# EAGLE schematic LPC1768 (EAGLE 5.10)
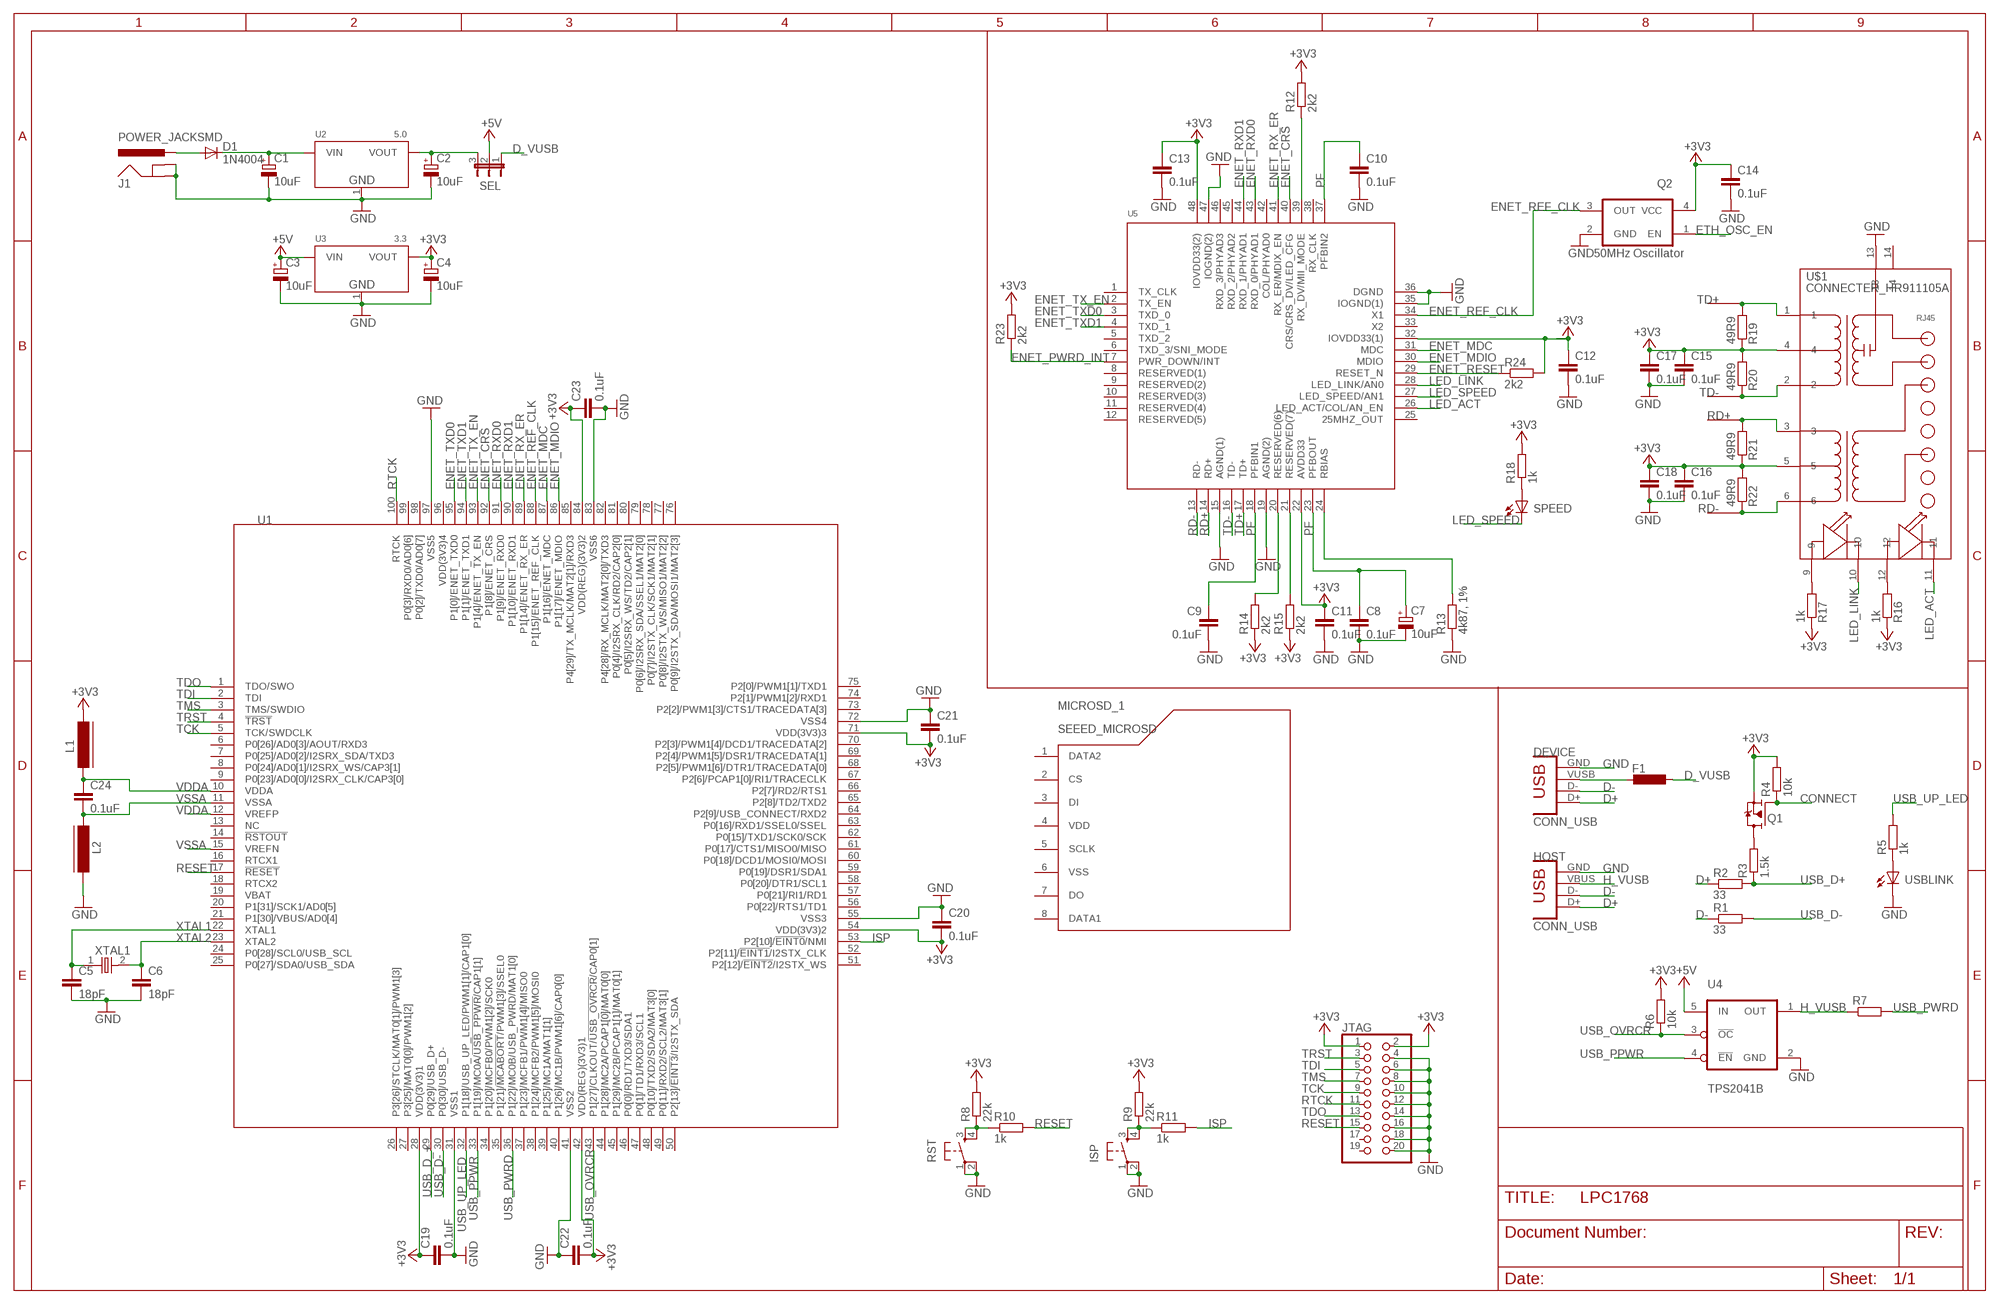
[diagram p0: schematic, sheet 1]

## Parts
C1  10uF  CAP_POLSMC_A  [SMC_A]
C2  10uF  CAP_POLSMC_A  [SMC_A]
C3  10uF  CAP_POLSMC_A  [SMC_A]
C4  10uF  CAP_POLSMC_A  [SMC_A]
C5  18pF  CAPC603  [C603]
C6  18pF  CAPC603  [C603]
C7  10uF  CAP_POLSMC_A  [SMC_A]
C8  0.1uF  CAPC603  [C603]
C9  0.1uF  CAPC603  [C603]
C10  0.1uF  CAPC603  [C603]
C11  0.1uF  CAPC603  [C603]
C12  0.1uF  CAPC603  [C603]
C13  0.1uF  CAPC603  [C603]
C14  0.1uF  CAPC603  [C603]
C15  0.1uF  CAPC603  [C603]
C16  0.1uF  CAPC603  [C603]
C17  0.1uF  CAPC603  [C603]
C18  0.1uF  CAPC603  [C603]
C19  0.1uF  CAPC603  [C603]
C20  0.1uF  CAPC603  [C603]
C21  0.1uF  CAPC603  [C603]
C22  0.1uF  CAPC603  [C603]
C23  0.1uF  CAPC603  [C603]
C24  0.1uF  CAPC603  [C603]
D1  1N4004  [DO41-10]
DEVICE  CONN_USB  CONN_USBMINI-B  [MINI-B]
F1  L-EUL1812  [L1812]
HOST  CONN_USB  CONN_USBA  [USB-A]
ISP  SMD_TACT_SMALL  [TACT_SWITCH_SMALL]
J1  POWER_JACKSMD  [POWER_JACK_SMD]
JTAG  PINHD-2X10SHROUDED  [PINSHRD_PTH_2X10]
L1  FERRITE_BEAD805  [FB805]
L2  FERRITE_BEAD805  [FB805]
MICROSD_1  SEEED_MICROSD  [SEEED_MICROSD]
Q1  TSM2301CX  [SOT23]
Q2  50MHz Oscillator  OSCILLATOR  [OSCILLATOR_7X5_SMD]
R1  33  RESISTORR603  [R603]
R2  33  RESISTORR603  [R603]
R3  1.5k  RESISTORR603  [R603]
R4  10k  RESISTORR603  [R603]
R5  1k  RESISTORR603  [R603]
R6  10k  RESISTORR603  [R603]
R7  RESISTORR603  [R603]
R8  22k  RESISTORR603  [R603]
R9  22k  RESISTORR603  [R603]
R10  1k  RESISTORR603  [R603]
R11  1k  RESISTORR603  [R603]
R12  2k2  RESISTORR603  [R603]
R13  4k87, 1%  RESISTORR603  [R603]
R14  2k2  RESISTORR603  [R603]
R15  2k2  RESISTORR603  [R603]
R16  1k  RESISTORR603  [R603]
R17  1k  RESISTORR603  [R603]
R18  1k  RESISTORR603  [R603]
R19  49R9  RESISTORR603  [R603]
R20  49R9  RESISTORR603  [R603]
R21  49R9  RESISTORR603  [R603]
R22  49R9  RESISTORR603  [R603]
R23  2k2  RESISTORR603  [R603]
R24  2k2  RESISTORR603  [R603]
RST  SMD_TACT_SMALL  [TACT_SWITCH_SMALL]
SEL  JP2WHEADER  [1X03]
SPEED  LED805  [LED-805]
U1  LPC1768FBD100  [LQFP100]
U2  5.0  LD1117-3.3SOT223  [SOT223]
U3  3.3  LD1117-3.3SOT223  [SOT223]
U4  TPS2041B  [SOT-23-5]
U5  DP83848C  [LQFP48]
U$1  CONNECTER_HR911105A  [CONNECTER_HR911105A]
USBLINK  LED805  [LED-805]
XTAL1  CRYSTAL  [HC-49U]

## Nets
+3V3: C4.+ C11.1 C12.1 C13.1 C14.1 C15.1 C16.1 C17.1 C18.1 C19.1 C20.2 C21.2 C22.2 C23.1 JTAG.1 JTAG.2 L1.2 Q1.2(S) Q2.4(VCC) R4.2 R6.2 R8.2 R9.2 R12.2 R14.1 R15.1 R16.1 R17.1 R18.2 R19.1 R20.2 R21.1 R22.2 R23.2 R24.2 U1.28(VDD(3V3)1) U1.42(VDD(REG)(3V3)1) U1.54(VDD(3V3)2) U1.71(VDD(3V3)3) U1.84(VDD(REG)(3V3)2) U3.2(VOUT) U5.22(AVDD33) U5.32(IOVDD33(1)) U5.48(IOVDD33(2)) U$1.4 U$1.5
+5V: C3.+ SEL.2 U3.3(VIN) U4.5(IN)
CONNECT: Q1.1(G) R4.1
D+: DEVICE.D+ HOST.D+ R2.1
D-: DEVICE.D- HOST.D- R1.1
D_VUSB: F1.1 SEL.1
ENET_CRS: U1.92(P1[8]/ENET_CRS) U5.40(CRS/CRS_DV/LED_CFG)
ENET_MDC: U1.87(P1[16]/ENET_MDC) U5.31(MDC)
ENET_MDIO: U1.86(P1[17]/ENET_MDIO) U5.30(MDIO)
ENET_PWRD_INT: R23.1 U5.7(PWR_DOWN/INT)
ENET_REF_CLK: Q2.3(OUT) U1.88(P1[15]/ENET_REF_CLK) U5.34(X1)
ENET_RESET: R24.1 U5.29(RESET_N)
ENET_RX_ER: U1.89(P1[14]/ENET_RX_ER) U5.41(RX_ER/MDIX_EN)
ENET_RXD0: U1.91(P1[9]/ENET_RXD0) U5.43(RXD_0/PHYAD1)
ENET_RXD1: U1.90(P1[10]/ENET_RXD1) U5.44(RXD_1/PHYAD1)
ENET_TX_EN: U1.93(P1[4]/ENET_TX_EN) U5.2(TX_EN)
ENET_TXD0: U1.95(P1[0]/ENET_TXD0) U5.3(TXD_0)
ENET_TXD1: U1.94(P1[1]/ENET_TXD1) U5.4(TXD_1)
ETH_OSC_EN: Q2.1(EN)
GND: C1.- C2.- C3.- C4.- C5.2 C6.2 C7.- C8.2 C9.2 C10.2 C11.2 C12.2 C13.2 C14.2 C15.2 C16.2 C17.2 C18.2 C19.2 C20.1 C21.1 C22.1 C23.2 DEVICE.GND HOST.GND ISP.1 ISP.2 J1.GND(GNDBREAK) J1.P$4(GND) JTAG.4 JTAG.6 JTAG.8 JTAG.10 JTAG.12 JTAG.14 JTAG.16 JTAG.18 JTAG.20 L2.2 Q2.2(GND) R13.1 RST.1 RST.2 U1.31(VSS1) U1.41(VSS2) U1.55(VSS3) U1.72(VSS4) U1.83(VSS6) U1.97(VSS5) U2.1(GND) U3.1(GND) U4.2(GND) U5.15(AGND(1)) U5.19(AGND(2)) U5.35(IOGND(1)) U5.36(DGND) U5.47(IOGND(2)) U$1.13 USBLINK.C
H_VUSB: HOST.VBUS(VUSB) R7.1 U4.1(OUT)
ISP: ISP.3 ISP.4 R9.1 R11.1 R11.2 U1.53(P2[10]/!EINT0!/NMI)
LED_ACT: U5.26(LED_ACT/COL/AN_EN) U$1.11
LED_LINK: U5.28(LED_LINK/AN0) U$1.10
LED_SPEED: SPEED.C U5.27(LED_SPEED/AN1)
N$1: Q1.3(D) R3.2
N$2: R5.1 USBLINK.A
N$3: C1.+ D1.C U2.3(VIN)
N$4: C2.+ SEL.3 U2.2(VOUT)
N$5: R12.1 U5.39(RX_DV/MII_MODE)
N$6: R13.2 U5.24(RBIAS)
N$7: R16.2 U$1.12
N$8: R15.2 U5.21(RESERVED(7))
N$9: R14.2 U5.20(RESERVED(6))
N$10: R17.2 U$1.9
N$11: R18.1 SPEED.A
N$12: D1.A J1.VIN0(PWR)
N$17: DEVICE.VUSB F1.2
PF: C7.+ C8.1 C9.1 C10.1 U5.18(PFBIN1) U5.23(PFBOUT) U5.37(PFBIN2)
RD+: R21.2 U5.14(RD+) U$1.3
RD-: R22.1 U5.13(RD-) U$1.6
RESET: JTAG.15 R8.1 R10.1 R10.2 RST.3 RST.4 U1.17(!RESET)
RTCK: JTAG.11 U1.100(RTCK)
TCK: JTAG.9 U1.5(TCK/SWDCLK)
TD+: R19.2 U5.17(TD+) U$1.1
TD-: R20.1 U5.16(TD-) U$1.2
TDI: JTAG.5 U1.2(TDI)
TDO: JTAG.13 U1.1(TDO/SWO)
TMS: JTAG.7 U1.3(TMS/SWDIO)
TRST: JTAG.3 U1.4(!TRST)
USB_D+: R2.2 R3.1
USB_D-: R1.2 U1.30(P0[30]/USB_D-)
USB_D_+: U1.29(P0[29]/USB_D+)
USB_OVRCR: R6.1 U1.43(P1[27]/CLKOUT/!USB_OVRCR!/CAP0[1]) U4.3(!OC)
USB_PPWR: U1.33(P1[19]/MC0A/!USB_PPWR!/CAP1[1]) U4.4(!EN)
USB_PWRD: R7.2 U1.36(P1[22]/MC0B/USB_PWRD/MAT1[0])
USB_UP_LED: R5.2 U1.32(P1[18]/USB_UP_LED/PWM1[1]/CAP1[0])
VDDA: C24.1 L1.1 U1.10(VDDA) U1.12(VREFP)
VSSA: C24.2 L2.1 U1.11(VSSA) U1.15(VREFN)
XTAL1: C5.1 U1.22(XTAL1) XTAL1.1
XTAL2: C6.1 U1.23(XTAL2) XTAL1.2
Unconnected: JTAG.17 JTAG.19 MICROSD_1.1(DATA2) MICROSD_1.2(CS) MICROSD_1.3(DI) MICROSD_1.4(VDD) MICROSD_1.5(SCLK) MICROSD_1.6(VSS) MICROSD_1.7(DO) MICROSD_1.8(DATA1) U1.6(P0[26]/AD0[3]/AOUT/RXD3) U1.7(P0[25]/AD0[2]/I2SRX_SDA/TXD3) U1.8(P0[24]/AD0[1]/I2SRX_WS/CAP3[1]) U1.9(P0[23]/AD0[0]/I2SRX_CLK/CAP3[0]) U1.13(NC) U1.14(!RSTOUT) U1.16(RTCX1) U1.18(RTCX2) U1.19(VBAT) U1.20(P1[31]/SCK1/AD0[5]) U1.21(P1[30]/VBUS/AD0[4]) U1.24(P0[28]/SCL0/USB_SCL) U1.25(P0[27]/SDA0/USB_SDA) U1.26(P3[26]/STCLK/MAT0[1]/PWM1[3]) U1.27(P3[25]/MAT0[0]/PWM1[2]) U1.34(P1[20]/MCFB0/PWM1[2]/SCK0) U1.35(P1[21]/!MCABORT!/PWM1[3]/SSEL0) U1.37(P1[23]/MCFB1/PWM1[4]/MISO0) U1.38(P1[24]/MCFB2/PWM1[5]/MOSI0) U1.39(P1[25]/MC1A/MAT1[1]) U1.40(P1[26]/MC1B/PWM1[6]/CAP0[0]) U1.44(P1[28]/MC2A/PCAP1[0]/MAT0[0]) U1.45(P1[29]/MC2B/PCAP1[1]/MAT0[1]) U1.46(P0[0]/RD1/TXD3/SDA1) U1.47(P0[1]/TD1/RXD3/SCL1) U1.48(P0[10]/TXD2/SDA2/MAT3[0]) U1.49(P0[11]/RXD2/SCL2/MAT3[1]) U1.50(P2[13]/!EINT3!/I2STX_SDA) U1.51(P2[12]/!EINT2!/I2STX_WS) U1.52(P2[11]/!EINT1!/I2STX_CLK) U1.56(P0[22]/RTS1/TD1) U1.57(P0[21]/RI1/RD1) U1.58(P0[20]/DTR1/SCL1) U1.59(P0[19]/DSR1/SDA1) U1.60(P0[18]/DCD1/MOSI0/MOSI) U1.61(P0[17]/CTS1/MISO0/MISO) U1.62(P0[15]/TXD1/SCK0/SCK) U1.63(P0[16]/RXD1/SSEL0/SSEL) U1.64(P2[9]/USB_CONNECT/RXD2) U1.65(P2[8]/TD2/TXD2) U1.66(P2[7]/RD2/RTS1) U1.67(P2[6]/PCAP1[0]/RI1/TRACECLK) U1.68(P2[5]/PWM1[6]/DTR1/TRACEDATA[0]) U1.69(P2[4]/PWM1[5]/DSR1/TRACEDATA[1]) U1.70(P2[3]/PWM1[4]/DCD1/TRACEDATA[2]) U1.73(P2[2]/PWM1[3]/CTS1/TRACEDATA[3]) U1.74(P2[1]/PWM1[2]/RXD1) U1.75(P2[0]/PWM1[1]/TXD1) U1.76(P0[9]/I2STX_SDA/MOSI1/MAT2[3]) U1.77(P0[8]/I2STX_WS/MISO1/MAT2[2]) U1.78(P0[7]/I2STX_CLK/SCK1/MAT2[1]) U1.79(P0[6]/I2SRX_SDA/SSEL1/MAT2[0]) U1.80(P0[5]/I2SRX_WS/TD2/CAP2[1]) U1.81(P0[4]/I2SRX_CLK/RD2/CAP2[0]) U1.82(P4[28]/RX_MCLK/MAT2[0]/TXD3) U1.85(P4[29]/TX_MCLK/MAT2[1]/RXD3) U1.96(VDD(3V3)4) U1.98(P0[2]/TXD0/AD0[7]) U1.99(P0[3]/RXD0/AD0[6]) U5.1(TX_CLK) U5.5(TXD_2) U5.6(TXD_3/SNI_MODE) U5.8(RESERVED(1)) U5.9(RESERVED(2)) U5.10(RESERVED(3)) U5.11(RESERVED(4)) U5.12(RESERVED(5)) U5.25(25MHZ_OUT) U5.33(X2) U5.38(RX_CLK) U5.42(COL/PHYAD0) U5.45(RXD_2/PHYAD2) U5.46(RXD_3/PHYAD3) U$1.14

## Library data of the parts
C1-C4 C7 = dp_devices:CAP_POL
C5 C6 C8-C24 = dp_devices:CAP
D1 = diode:1N4004: DIODE general purpose rectifier, 1 A
DEVICE HOST = dp_devices:CONN_USB: USB connector
F1 = rcl:L-EU: INDUCTOR, European symbol
ISP RST = dp_devices:SMD_TACT_SMALL
J1 = SparkFun:POWER_JACK: Power Jack This is the standard 5.5mm barrel jack for power. The PTH is the most common, proven, reliable, footprint. All others are experimental. The Slot footprint only works if the mill layer is transmitted to the PCB fab house so be warned. Spark Fun Electronics SKU : PRT-00119. Mating wall wart : TOL-00298 (and others)
JTAG = pinhead - Copy:PINHD-2X10: PIN HEADER
L1 L2 = dp_devices:FERRITE_BEAD
MICROSD_1 = DP-webplatformv1.1:SEEED_MICROSD
Q1 = dp_devices:TSM2301CX: 20V P-Channel Enhancement Mode MOSFET
Q2 = dp_devices:OSCILLATOR: Oscillator
R1-R24 = dp_devices:RESISTOR
SEL = jumper:JP2W: JUMPER
SPEED USBLINK = dp_devices:LED
U1 = LPC1768:LPC1768
U2 U3 = dp_devices:LD1117-3.3
U4 = dp_devices:TPS2041B: High side power distribution switch
U5 = DP83848:DP83848C
U$1 = dp_devices:CONNECTER_HR911105A
XTAL1 = dp_devices:CRYSTAL